# Altium schematic sheet Main.SchDoc
size A4; SheetNumber: 1; SheetTotal: 8
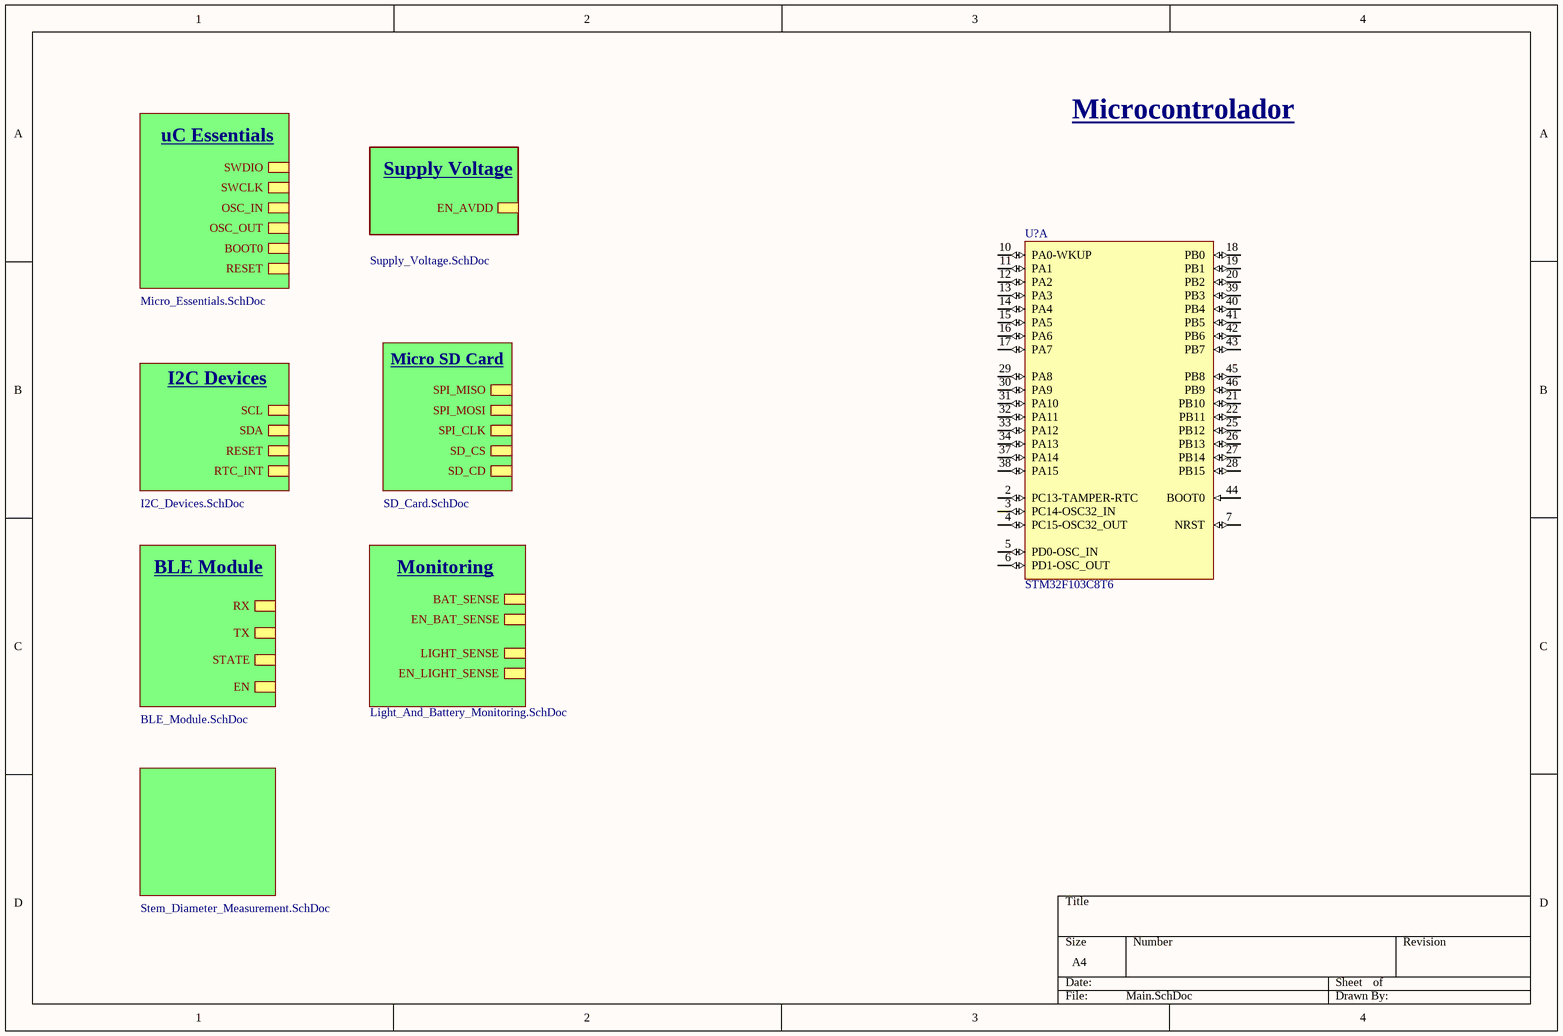
[diagram p0: Main.SchDoc]

## Parts
U?  STM32F103C8T6  [STM-LQFP48_L]  (part A of 2)

## Sub-sheets
BLE_Module = BLE_Module.SchDoc: RX, TX, STATE, EN  | Titulo: BLE Module
Light_And_Battery_Monitoring = Light_And_Battery_Monitoring.SchDoc: BAT_SENSE, EN_BAT_SENSE, LIGHT_SENSE, EN_LIGHT_SENSE  | Titulo: Monitoring
Micro_Essentials = Micro_Essentials.SchDoc: RESET, BOOT0, OSC_OUT, OSC_IN, SWCLK, SWDIO  | Titulo: uC Essentials
Real_Time_Clock = I2C_Devices.SchDoc: SCL, SDA, RESET, RTC_INT  | Titulo: I2C Devices
SD_Card = SD_Card.SchDoc: SPI_MISO, SPI_MOSI, SPI_CLK, SD_CD, SD_CS  | Titulo: Micro SD Card
Stem_Diameter_Measurement = Stem_Diameter_Measurement.SchDoc: no entries
Supply_Voltage = Supply_Voltage.SchDoc: EN_AVDD  | Titulo: Supply Voltage

## Nets

Not connected (* = marked no-connect by the designer): U? 2(PC13-TAMPER-RTC) 3(PC14-OSC32_IN) 4(PC15-OSC32_OUT) 5(PD0-OSC_IN) 6(PD1-OSC_OUT) 7(NRST) 10(PA0-WKUP) 11(PA1) 12(PA2) 13(PA3) 14(PA4) 15(PA5) 16(PA6) 17(PA7) 18(PB0) 19(PB1) 20(PB2) 21(PB10) 22(PB11) 25(PB12) 26(PB13) 27(PB14) 28(PB15) 29(PA8) 30(PA9) 31(PA10) 32(PA11) 33(PA12) 34(PA13) 37(PA14) 38(PA15) 39(PB3) 40(PB4) 41(PB5) 42(PB6) 43(PB7) 44(BOOT0) 45(PB8) 46(PB9)

## Notes on the sheet
- Microcontrolador

## Library data of the parts
U? = CMP-0237-00215-3: ARM Cortex-M3 32-bit MCU, 64 KB Flash, 20 KB Internal RAM, 37 I/Os, 48-pin LQFP, -40 to 85 degC, Tray; Supply Voltage(Vcc) min (V): 2; Internal RAM Size (kB): 20; FLASH Size (Prog) (kB): 64; A/D Converter: 2x12-bit (10 Channel); I/Os (High Current): 37; Operating Frequency(F) (Processor speed) (MHz): 72; Core: ARM Cortex-M3; ComponentLink3Description: Package Specification; Mounting Technology: Surface Mount; PartNumber: STM32F103C8T6; PackageReference: LQFP48; Packing: Tray; ComponentLink3URL: http://www.st.com/st-web-ui/static/active/en/resource/technical/document/datasheet/DM00058181.pdf; DatasheetVersion: Rev. 16; ComponentLink1URL: http://www.st.com/web/en/home.html; PackageVersion: Rev. 6, 06/2013; ComponentLink2URL: http://www.st.com/st-web-ui/static/active/en/resource/technical/document/datasheet/CD00161566.pdf; ComponentLink1Description: Manufacturer URL; ComponentLink2Description: Datasheet; PackageDescription: 48-Pin Low Profile Quad Flat Package, 7 x 7 mm Body, 0.5 mm Pitch